# Altium schematic sheet rf_tx_pa.SchDoc: mcHF Pro Transceiver RF board
size A3; Author: Krassi Atanassov; CompanyName: MØNKA; Engineer: For radio amateurs experimentation, non-commercial use only. Thank you!; Revision: 0.8.5; SheetTotal: 14
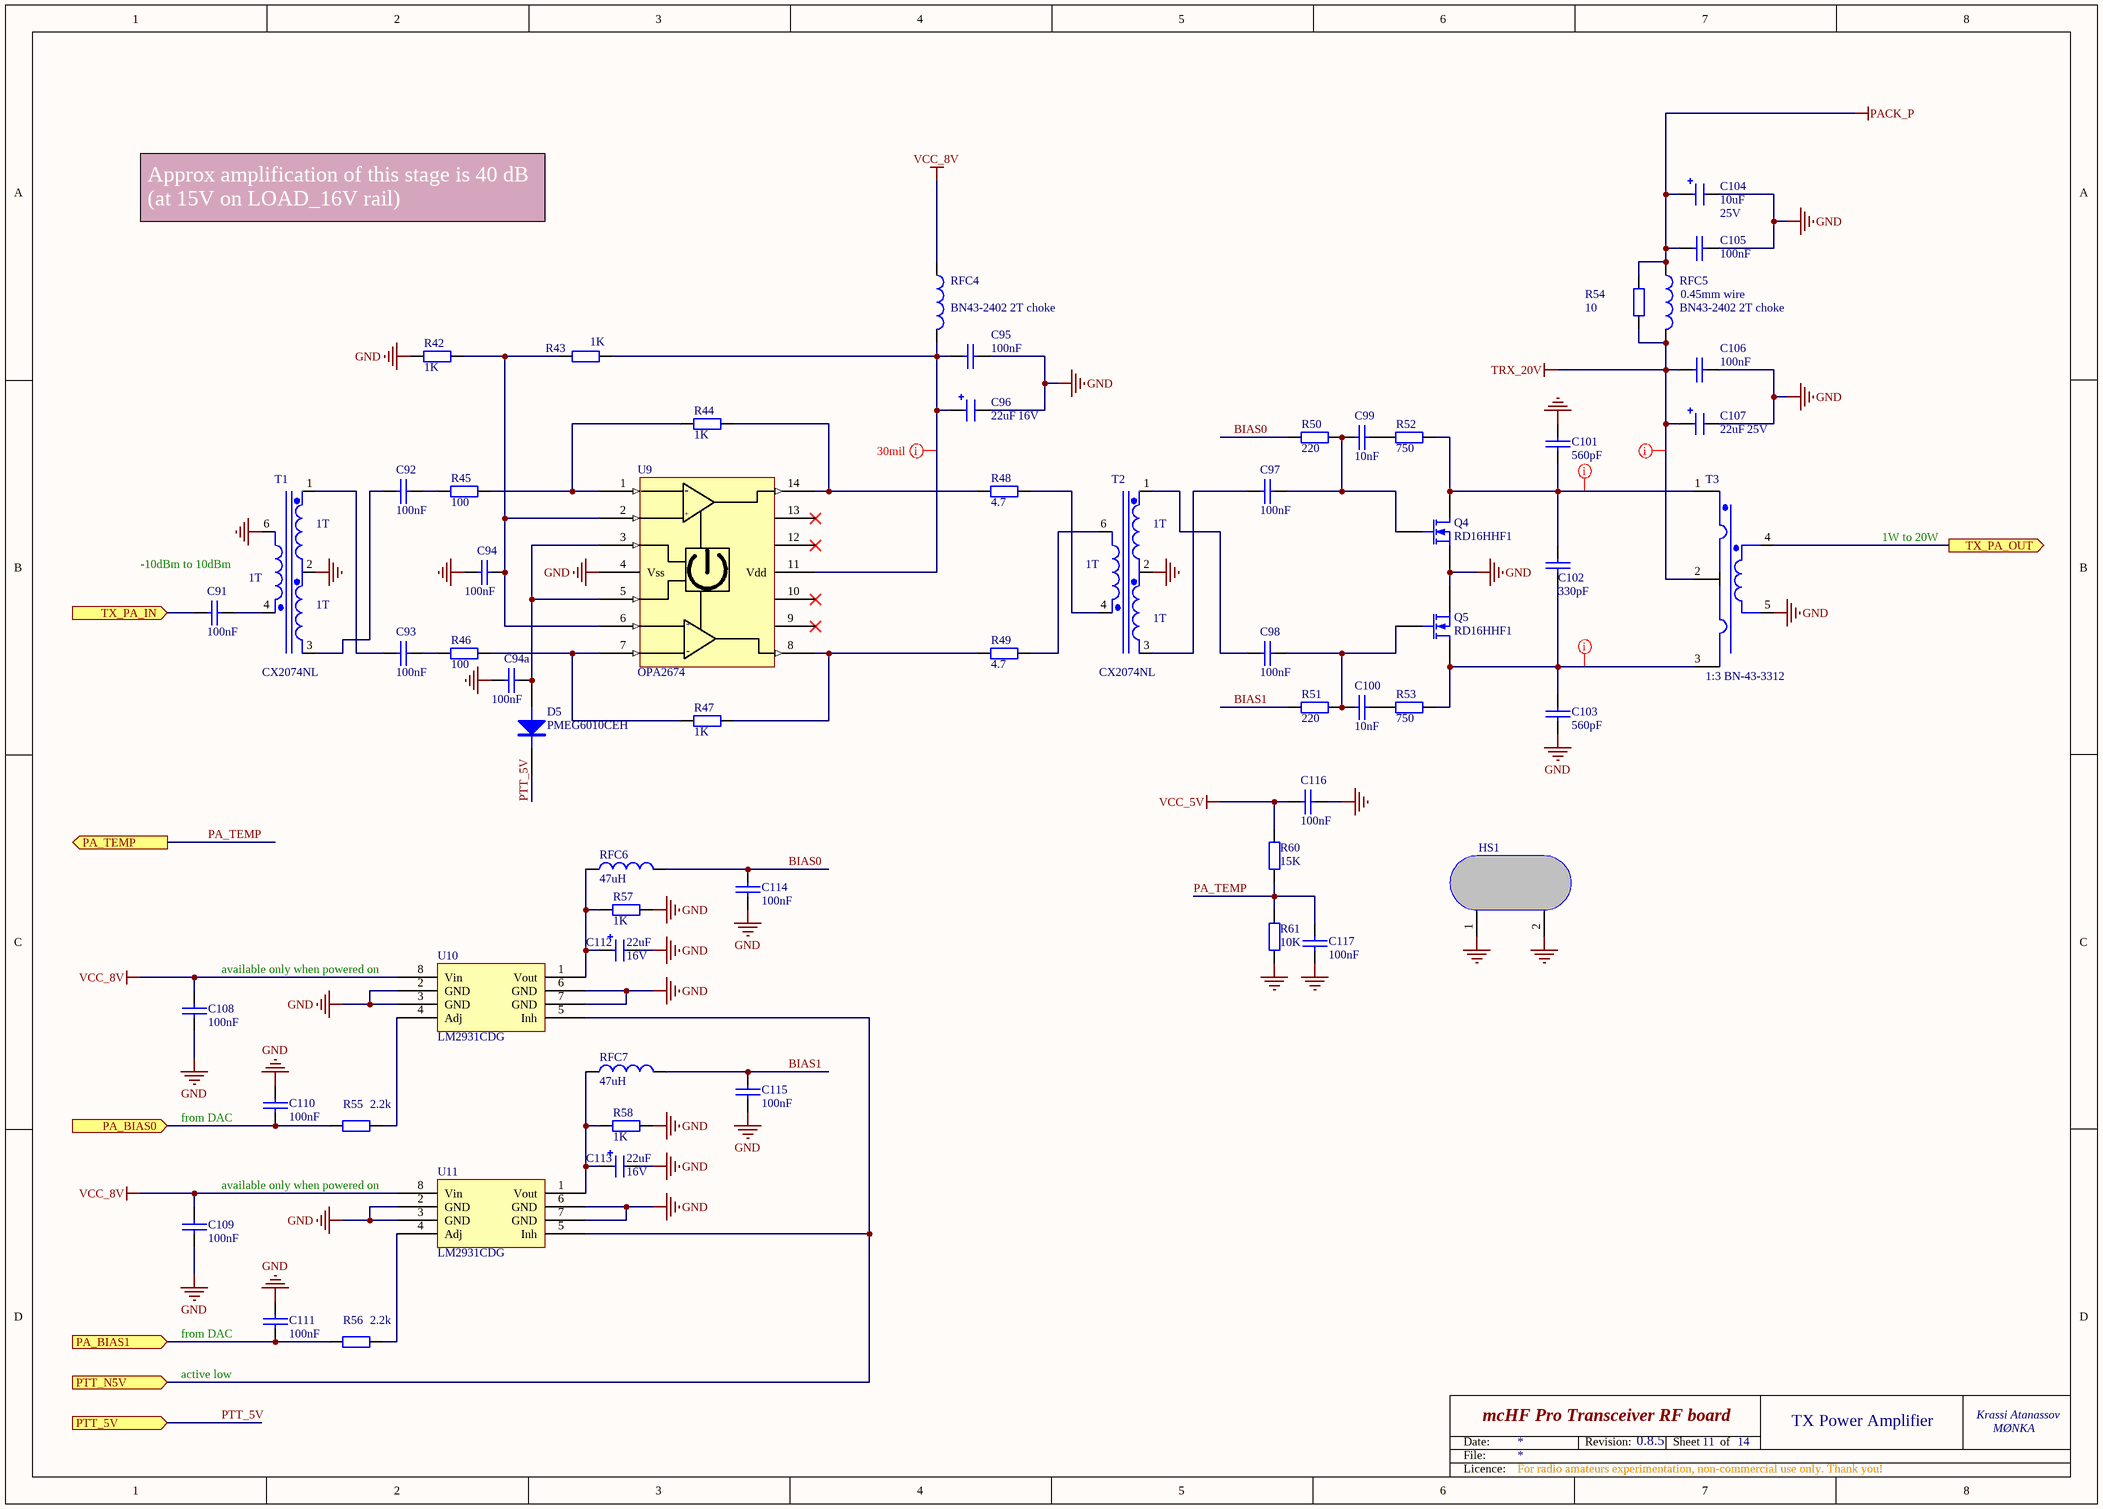
[diagram p0: rf_tx_pa.SchDoc]

## Parts
C91  100nF  [0805]
C92  100nF  [0805]
C93  100nF  [0805]
C94  100nF  [0805]
C94a  100nF  [0805]
C95  100nF  [0805]
C96  22uF  Voltage: 16V  [1206_Elec_Cap]
C97  100nF  [0805]
C98  100nF  [0805]
C99  10nF  [0805]
C100  10nF  [0805]
C101  560pF  [0805]
C102  330pF  [0805]
C103  560pF  [0805]
C104  10uF  Voltage: 25V  [1206_Elec_Cap]
C105  100nF  [0805]
C106  100nF  [0805]
C107  22uF  Voltage: 25V  [1206_Elec_Cap]
C108  100nF  [0805]
C109  100nF  [0805]
C110  100nF  [0805]
C111  100nF  [0805]
C112  22uF  Voltage: 16V  [1206_Elec_Cap]
C113  22uF  Voltage: 16V  [1206_Elec_Cap]
C114  100nF  [0805]
C115  100nF  [0805]
C116  100nF  [0805]
C117  100nF  [0805]
D5  PMEG6010CEH  [SOD87]
HS1  RD16HHF1x2  [TO-220_5_DUAL_HS]  (value not drawn)
Q4  RD16HHF1  [TO-220c]
Q5  RD16HHF1  [TO-220c]
R42  1K  [0805]
R43  1K  [0805]
R44  1K  [0805]
R45  100  [0805]
R46  100  [0805]
R47  1K  [0805]
R48  4.7  [0805]
R49  4.7  [0805]
R50  220  [0805]
R51  220  [0805]
R52  750  [0805]
R53  750  [0805]
R54  10  [0805]
R55  2.2k  [0805]
R56  2.2k  [0805]
R57  1K  [0805]
R58  1K  [0805]
R60  15K  [0805]
R61  10K  [0805]
RFC4  BN43-2402 2T choke  [F_Bead_Flat]
RFC5  BN43-2402 2T choke  [F_Bead]
RFC6  47uH  [0805]
RFC7  47uH  [0805]
T1  CX2074NL  [SOP5_NEW1]
T2  CX2074NL  [SOP5_NEW1]
T3  1:3 BN-43-3312  [PA_OUT_TRM]
U9  OPA2674  [SO-14-PRO]
U10  LM2931CDG  [SO-8-PRO]
U11  LM2931CDG  [SO-8-PRO]

## Ports
PA_BIAS0 (in), PA_BIAS1 (in), PA_TEMP (out), PTT_5V (in), PTT_N5V (in), TX_PA_IN (in), TX_PA_OUT (out)

## Nets
GND: C94.1 C94a.1 C95.1 C96.2 C101.1 C103.2 C104.2 C105.1 C106.1 C107.2 C108.2 C109.2 C110.2 C111.1 C112.2 C113.2 C114.1 C115.1 C116.1 C117.2 HS1.1(GND) HS1.2(GND) Q4.2(S) Q5.2(S) R42.1 R57.1 R58.1 R61.2 T1.2(SecCmn) T1.6(Pri+) T2.2(SecCmn) T3.5(Sec-) U9.4(Vss) U10.2(GND) U10.3(GND) U10.6(GND) U10.7(GND) U11.2(GND) U11.3(GND) U11.6(GND) U11.7(GND)
PACK_P: C104.1 C105.2 R54.2 RFC5.1
TRX_20V: C106.2 C107.1 R54.1 RFC5.2 T3.2(Pri_Common)
VCC_5V: C116.2 R60.1
VCC_8V: C108.1 C109.1 RFC4.1 U10.8(Vin) U11.8(Vin)
BIAS0: C114.2 R50.2 RFC6.2
BIAS1: C115.2 R51.2 RFC7.2
PA_BIAS0: C110.1 R55.1 ; port PA_BIAS0
PA_BIAS1: C111.2 R56.1 ; port PA_BIAS1
PA_TEMP: C117.1 R60.2 R61.1 ; port PA_TEMP
PTT_5V: D5.2(K) ; port PTT_5V
PTT_N5V: U10.5(Inh) U11.5(Inh) ; port PTT_N5V
TX_PA_IN: C91.2 ; port TX_PA_IN
TX_PA_OUT: T3.4(Sec+) ; port TX_PA_OUT
NetC91_1: C91.1 T1.4(Pri-)
NetC92_1: C92.1 T1.3(Sec180)
NetC92_2: C92.2 R45.2
NetC93_1: C93.1 T1.1(Sec0)
NetC93_2: C93.2 R46.2
NetC94_2: C94.2 R42.2 R43.2 U9.2 U9.6
NetC94a_2: C94a.2 D5.1(A) U9.3 U9.5
NetC95_2: C95.2 C96.1 R43.1 RFC4.2 U9.11(Vdd)
NetC97_1: C97.1 C99.1 Q4.1(G) R50.1
NetC97_2: C97.2 T2.3(Sec180)
NetC98_1: C98.1 C100.1 Q5.1(G) R51.1
NetC98_2: C98.2 T2.1(Sec0)
NetC99_2: C99.2 R52.2
NetC100_2: C100.2 R53.2
NetC101_2: C101.2 C102.1 Q4.3(D) R52.1 T3.1(Pri_0_deg)
NetC102_2: C102.2 C103.1 Q5.3(D) R53.1 T3.3(Pri_180_deg)
NetC112_1: C112.1 R57.2 RFC6.1 U10.1(Vout)
NetC113_1: C113.1 R58.2 RFC7.1 U11.1(Vout)
NetR44_1: R44.1 R48.2 U9.14
NetR44_2: R44.2 R45.1 U9.1
NetR46_1: R46.1 R47.2 U9.7
NetR47_1: R47.1 R49.2 U9.8
NetR48_1: R48.1 T2.4(Pri-)
NetR49_1: R49.1 T2.6(Pri+)
NetR55_2: R55.2 U10.4(Adj)
NetR56_2: R56.2 U11.4(Adj)

Not connected (* = marked no-connect by the designer): U9 9* 10* 12* 13*

## Layout directives
rule Width Constraint [Pref Width = 50mil    Min Width = 50mil    Max Width = 50mil]: NetC101_2, NetC102_2
rule Width Constraint [Pref Width = 30mil    Min Width = 30mil    Max Width = 30mil]: NetC95_2
rule Width Constraint [Pref Width = 80mil    Min Width = 80mil    Max Width = 80mil]: TRX_20V

## Notes on the sheet
- Approx amplification of this stage is 40 dB  (at 15V on LOAD_16V rail)
- (near RFC5) 0.45mm wire
- -10dBm to 10dBm
- (near T1) 1T
- (near T2) 1T
- 1W to 20W
- available only when powered on
- (near C110) from DAC
- (near C111) active low
- (near C111) from DAC
- 11
- TX Power Amplifier
- Date:
- File:
- Revision:
- Sheet
- of
- Licence:
- (in symbol OPA2674) -; +

## Library data of the parts
C91 C110 C111 = CAP: Capacitor; QT Order: QCC-00154; Price: 0.068
C92-C94 C94a C95 C97-C103 C105 C106 C108 C109 C114-C117 = CAP: Capacitor; Voltage: 100V; QT Order: QCC-00154; Price: 0.068
C96 C107 C112 C113 = CAP-POL: Electrolitic capacitor; QT Order: QCC-00202; Price: 0.235
C104 = CAP-POL: Electrolitic capacitor; QT Order: QCC-00166; Price: 0.204
D5 = PMEG6010CEH: DIODE, SCHOTTKY, 1A, 60V, SOD-123F; QT Order: QCD-00034; Price: 0.085
HS1 = RD16HHF1_DUAL_HEATSINK: RF MOSFET x2 heatsink; Order: EB 121171160336; Price: 7.375
Q4 Q5 = RD16HHF1: Silicon RF Power MOS FET; Order: EB 121171160336; Price: 7.375
R42-R44 R47-R49 R57 R58 R60 R61 = RES: Resistor; QT Order: QCR-00579; Price: 0.061
R45 R46 R50-R53 = RES: Resistor; QT Order: QCR-00309; Price: 0.007
R54 = RES: Resistor; QT Order: QCR-00279; Price: 0.013
R55 R56 = RES: Resistor; QT Order: QCR-00333; Price: 0.046
RFC4 RFC5 = FER_BEAD: BN43-2402 1t choke; Notes: post assembly; Price: 0.298
RFC6 RFC7 = TDK-NLV25T: INDUCTOR, SIGNAL LINE, 4.7UH, 1005; Price: 0.166
T1 T2 = CX2074NL: Transformer 4:1; Price: 0.298
T3 = PA_OUT_TR: 1:3 BN-43-3312 transformer; Notes: post assembly; Price: 0.534
U9 = OPA2674: Dual Wideband, High Output Current / Operational Amplifier with Current Limit; Price: 0.38
U10 U11 = LM2931CDG: 100 mA, Adjustable Output,  LDO Voltage Regulator with  60 V Load Dump Protection; Price: 0.39